# EAGLE board OPBS-Muscle (EAGLE 6.4), part 1 of 2
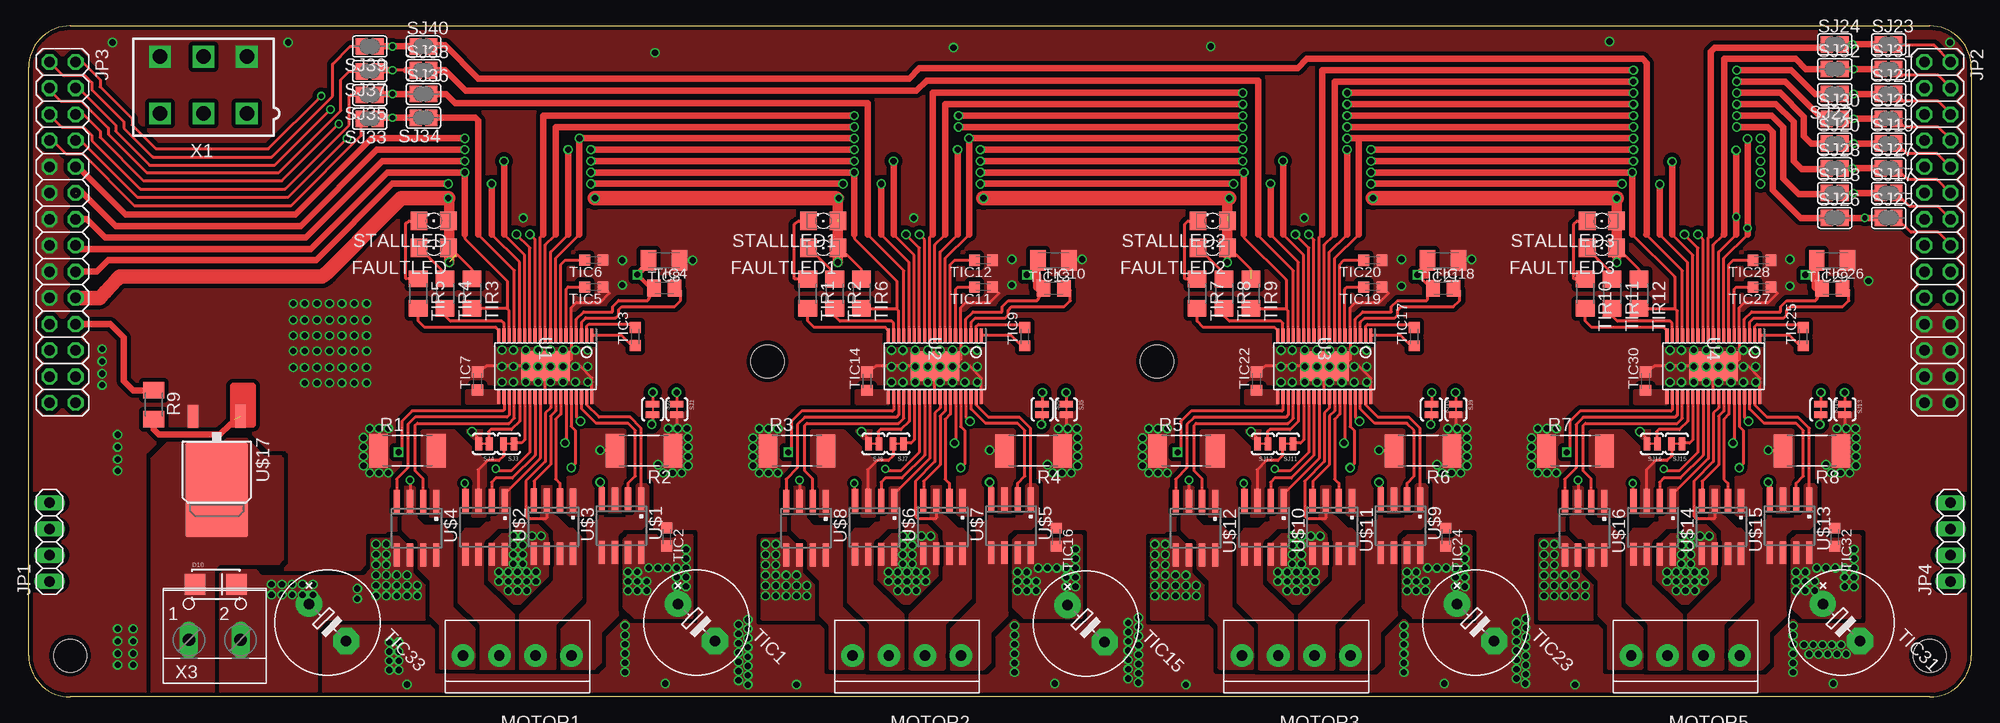
[diagram p7: board, top side]
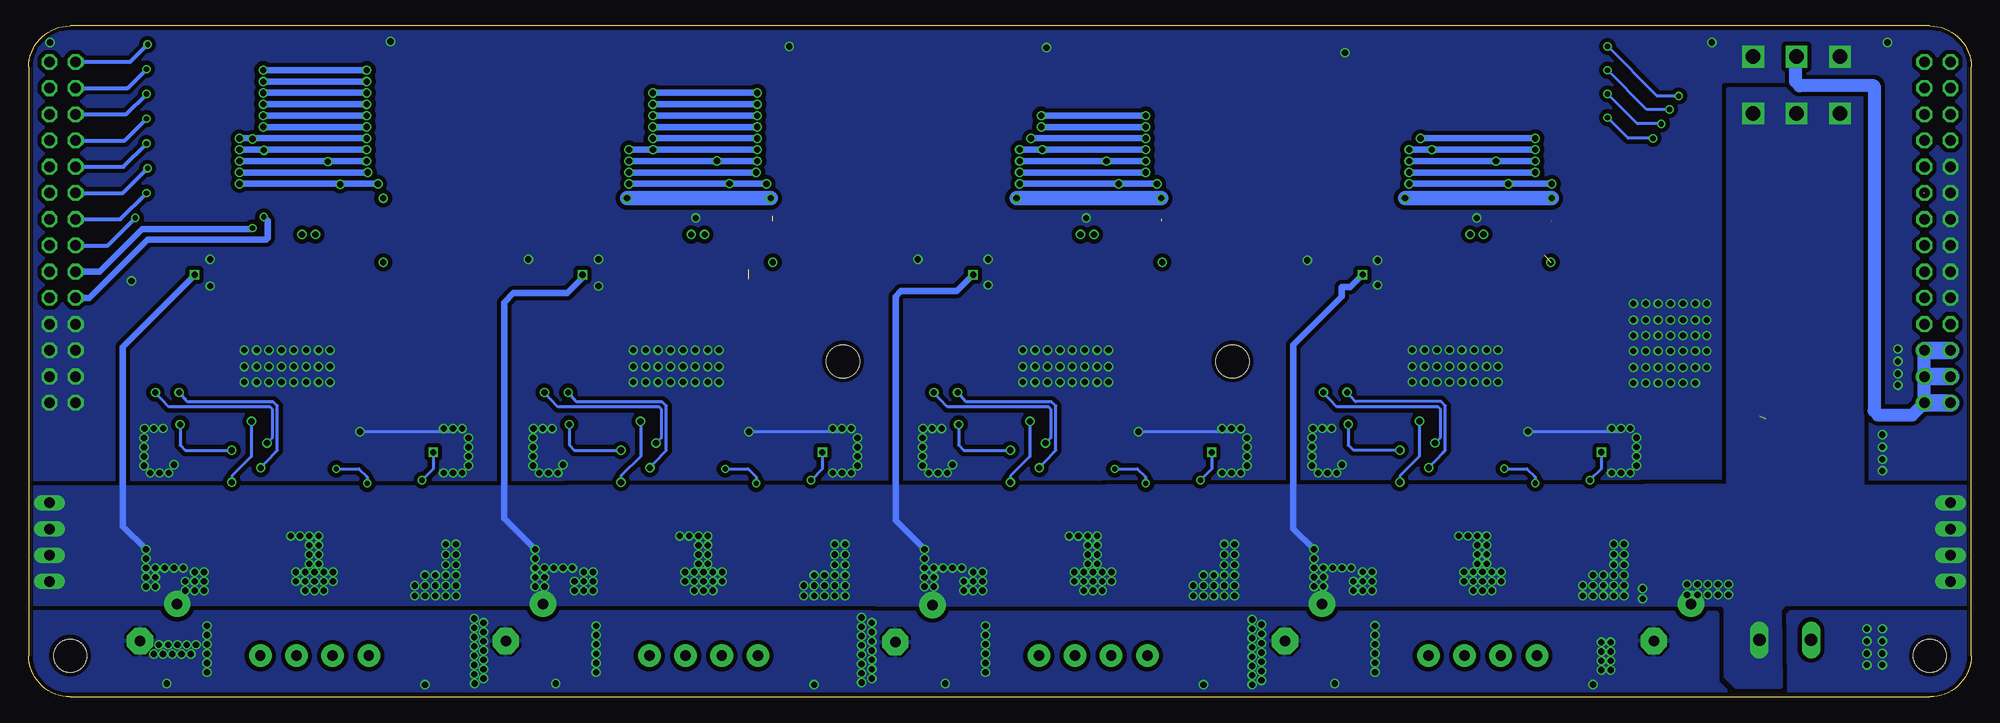
[diagram p8: board, bottom side, seen from below]

Size 188 x 65 mm. Coordinates in mm from the lower left corner, seen from the top.
Outline: 4,65 184,65 arc-90 188,61 188,4 arc-90 184,0 4,0 arc-90 0,4 0,61 arc-90 4,65
Copper layers (1*16): Top 0.035mm / dielectric 1.5mm / Bottom 0.035mm
Design rules "dirt_cheap_dirty_boards.v1": minimum track width 5mil, minimum drill 12mil, track to track 5mil, track to pad 5mil, pad to pad 5mil, via to via 5mil, smd to smd 0mil, copper to edge 10mil, drill to drill 10mil, minimum pad ring 10mil, minimum via ring 6mil, stop-mask expansion 2mil, vias tented up to drill 25mil, thermal gap 10mil
Holes 3.2 mm at 4,4 184,4 71.5,32.5 109.2,32.5

## Footprints (pad centres in the part's own frame; a part is rotated, then mirrored left to right if it is on the bottom)
SMA-DIODE_ALT = smd 2 x 2: A -2,0; C 2,0
1206 = smd 1.6 x 1.803: A -1.422,0; C 1.422,0
1X04 = drill 1.016 long: 1 -3.81,0; 2 -1.27,0; 3 1.27,0; 4 3.81,0
2X14 = drill 1.016 octagon: 1 -16.51,-1.27; 2 -16.51,1.27; 3 -13.97,-1.27; 4 -13.97,1.27; 5 -11.43,-1.27; 6 -11.43,1.27; 7 -8.89,-1.27; 8 -8.89,1.27; 9 -6.35,-1.27; 10 -6.35,1.27; 11 -3.81,-1.27; 12 -3.81,1.27; 13 -1.27,-1.27; 14 -1.27,1.27; 15 1.27,-1.27; 16 1.27,1.27; 17 3.81,-1.27; 18 3.81,1.27; 19 6.35,-1.27; 20 6.35,1.27; 21 8.89,-1.27; 22 8.89,1.27; 23 11.43,-1.27; 24 11.43,1.27; 25 13.97,-1.27; 26 13.97,1.27; 27 16.51,-1.27; 28 16.51,1.27
1X04-3.5MM = drill 1 pad 2.184: 1 -5.25,0; 2 -1.75,0; 3 1.75,0; 4 5.25,0
R2512 = smd 1.8 x 3.2: 1 -2.8,0; 2 2.8,0
M1206 = smd 1.6 x 2: 1 -1.4,0; 2 1.4,0
SJ_2S-TRACE = smd 0.635 x 1.27: 1 -0.508,0; 2 0.508,0
SJ = smd 1.168 x 1.6: 1 -0.762,0; 2 0.762,0
E5-10,5 = drill 1.016 pad 2.54: + -2.54,0 | drill 1.016 pad 2.54 octagon: - 2.54,0
C0603K = smd 1.05 x 1.08: 1 -0.875,0; 2 0.875,0
C0805K = smd 1.3 x 1.6: 1 -1,0; 2 1,0
C1206K = smd 1.5 x 2: 1 -1.5,0; 2 1.5,0
R1206 = smd 1.6 x 1.803: 1 -1.422,0; 2 1.422,0
DCP0038A_N = smd 1.397 x 0.305: 1 -2.95,4.5; 2 -2.95,4; 3 -2.95,3.5; 4 -2.95,3; 5 -2.95,2.5; 6 -2.95,2; 7 -2.95,1.5; 8 -2.95,1; 9 -2.95,0.5; 10 -2.95,0; 11 -2.95,-0.5; 12 -2.95,-1; 13 -2.95,-1.5; 14 -2.95,-2; 15 -2.95,-2.5; 16 -2.95,-3; 17 -2.95,-3.5; 18 -2.95,-4; 19 -2.95,-4.5; 20 2.95,-4.5; 21 2.95,-4; 22 2.95,-3.5; 23 2.95,-3; 24 2.95,-2.5; 25 2.95,-2; 26 2.95,-1.5; 27 2.95,-1; 28 2.95,-0.5; 29 2.95,0; 30 2.95,0.5; 31 2.95,1; 32 2.95,1.5; 33 2.95,2; 34 2.95,2.5; 35 2.95,3; 36 2.95,3.5; 37 2.95,4; 38 2.95,4.5 | smd 2.896 x 4.699: 39 0,0
CSD88537ND = smd 0.6 x 2.2: D1_1 0.635,6.41; D1_2 1.905,6.41; D2_1 3.175,6.41; D22 4.445,6.41; G1 1.905,1.21; G2 4.445,1.21; S1 0.635,1.21; S2 3.175,1.21
D-PAK_TO252AA = smd 1.067 x 2.184: 1 -2.286,-4.572; 3 2.286,-4.572 | smd 6.096 x 9.144: 2 0,2.54
5566-6 = drill 1.4 square: 1 4.2,-2.75; 2 0,-2.75; 3 -4.2,-2.75; 4 4.2,2.75; 5 0,2.75; 6 -4.2,2.75
W237-102 = drill 1.194 long: 1 -2.5,-1.27; 2 2.5,-1.27

## Placement (x,y rotation side)
D10  [SMA-DIODE_ALT]  18.1,10.9 0 top
FAULTLED  RED  [1206]  39.21,43.5 180 top
FAULTLED1  RED  [1206]  76.91,43.49 180 top
FAULTLED2  RED  [1206]  114.6,43.49 180 top
FAULTLED3  RED  [1206]  152.26,43.49 180 top
JP1  [1X04]  2,15 90 top
JP2  [2X14]  184.73,45 270 top
JP3  [2X14]  3.27,45 270 top
JP4  [1X04]  186,15 90 top
MOTOR1  1X4-3.5MM  [1X04-3.5MM]  47.29,4 0 top
MOTOR2  1X4-3.5MM  [1X04-3.5MM]  84.99,4 0 top
MOTOR3  1X4-3.5MM  [1X04-3.5MM]  122.68,4 0 top
MOTOR5  1X4-3.5MM  [1X04-3.5MM]  160.34,4 0 top
R1  [R2512]  36.64,23.85 0 top
R2  [R2512]  59.54,23.85 180 top
R3  [R2512]  74.34,23.84 0 top
R4  [R2512]  97.24,23.84 180 top
R5  [R2512]  112.03,23.84 0 top
R6  [R2512]  134.93,23.84 180 top
R7  [R2512]  149.69,23.84 0 top
R8  [R2512]  172.59,23.84 180 top
R9  10R  [M1206]  12.1,28.3 270 top
SJ1  SOLDERJUMPERTRACE  [SJ_2S-TRACE]  62.72,27.86 270 top
SJ2  SOLDERJUMPERTRACE  [SJ_2S-TRACE]  60.37,27.86 270 top
SJ3  SOLDERJUMPERTRACE  [SJ_2S-TRACE]  46.46,24.52 180 top
SJ4  SOLDERJUMPERTRACE  [SJ_2S-TRACE]  44.06,24.52 180 top
SJ5  SOLDERJUMPERTRACE  [SJ_2S-TRACE]  100.42,27.85 270 top
SJ6  SOLDERJUMPERTRACE  [SJ_2S-TRACE]  98.07,27.85 270 top
SJ7  SOLDERJUMPERTRACE  [SJ_2S-TRACE]  84.16,24.51 180 top
SJ8  SOLDERJUMPERTRACE  [SJ_2S-TRACE]  81.76,24.51 180 top
SJ9  SOLDERJUMPERTRACE  [SJ_2S-TRACE]  138.11,27.85 270 top
SJ10  SOLDERJUMPERTRACE  [SJ_2S-TRACE]  135.76,27.85 270 top
SJ11  SOLDERJUMPERTRACE  [SJ_2S-TRACE]  121.85,24.51 180 top
SJ12  SOLDERJUMPERTRACE  [SJ_2S-TRACE]  119.45,24.51 180 top
SJ13  SOLDERJUMPERTRACE  [SJ_2S-TRACE]  175.77,27.85 270 top
SJ14  SOLDERJUMPERTRACE  [SJ_2S-TRACE]  173.42,27.85 270 top
SJ15  SOLDERJUMPERTRACE  [SJ_2S-TRACE]  159.51,24.51 180 top
SJ16  SOLDERJUMPERTRACE  [SJ_2S-TRACE]  157.11,24.51 180 top
SJ17  [SJ]  180,48.8 0 top
SJ18  [SJ]  174.8,48.8 0 top
SJ19  [SJ]  180,53.6 0 top
SJ20  [SJ]  174.8,53.6 0 top
SJ21  [SJ]  180,58.4 0 top
SJ22  [SJ]  174.8,58.4 180 top
SJ23  [SJ]  180,63.2 0 top
SJ24  [SJ]  174.8,63.2 0 top
SJ25  [SJ]  180,46.4 0 top
SJ26  [SJ]  174.8,46.4 0 top
SJ27  [SJ]  180,51.2 0 top
SJ28  [SJ]  174.8,51.2 0 top
SJ29  [SJ]  180,56 0 top
SJ30  [SJ]  174.8,56 0 top
SJ31  [SJ]  180,60.8 0 top
SJ32  [SJ]  174.8,60.8 0 top
SJ33  [SJ]  33,56 180 top
SJ34  [SJ]  38.2,56.1 180 top
SJ35  [SJ]  33,58.3 180 top
SJ36  [SJ]  38.2,58.4 0 top
SJ37  [SJ]  33,60.6 180 top
SJ38  [SJ]  38.2,60.7 0 top
SJ39  [SJ]  33,63 180 top
SJ40  [SJ]  38.2,63 0 top
STALLLED  RED  [1206]  39.21,46.11 180 top
STALLLED1  RED  [1206]  76.91,46.1 180 top
STALLLED2  RED  [1206]  114.6,46.1 180 top
STALLLED3  RED  [1206]  152.26,46.1 180 top
TIC1  Alu 100uf 100v 20%  [E5-10,5]  64.62,7.21 315 top
TIC2  0.01uf 100v 10% CER  [C0603K]  61.74,15.49 270 top
TIC3  0.1UF 100V 10% CER  [C0603K]  58.7,34.9 90 top
TIC4  1UF 50V 10%  [C0805K]  61.5,39.6 0 top
TIC5  0.1UF 25V 10% CER  [C0603K]  54.7,39.7 180 top
TIC6  1UF 16V 10% CER  [C0603K]  54.7,42.3 180 top
TIC7  1000pF 16v CERM  [C0603K]  43.43,30.59 90 top
TIC8  1UF 100V 10% CER  [C1206K]  61.5,42.3 180 top
TIC9  0.1UF 100V 10% CER  [C0603K]  96.4,34.89 90 top
TIC10  1UF 50V 10%  [C0805K]  99.2,39.59 0 top
TIC11  0.1UF 25V 10% CER  [C0603K]  92.4,39.69 180 top
TIC12  1UF 16V 10% CER  [C0603K]  92.4,42.29 180 top
TIC13  1UF 100V 10% CER  [C1206K]  99.2,42.29 180 top
TIC14  1000pF 16v CERM  [C0603K]  81.13,30.58 90 top
TIC15  Alu 100uf 100v 20%  [E5-10,5]  102.33,7.11 315 top
TIC16  0.01uf 100v 10% CER  [C0603K]  99.44,15.48 270 top
TIC17  0.1UF 100V 10% CER  [C0603K]  134.09,34.89 90 top
TIC18  1UF 50V 10%  [C0805K]  136.89,39.59 0 top
TIC19  0.1UF 25V 10% CER  [C0603K]  130.09,39.69 180 top
TIC20  1UF 16V 10% CER  [C0603K]  130.09,42.29 180 top
TIC21  1UF 100V 10% CER  [C1206K]  136.89,42.29 180 top
TIC22  1000pF 16v CERM  [C0603K]  118.82,30.58 90 top
TIC23  Alu 100uf 100v 20%  [E5-10,5]  140.03,7.21 315 top
TIC24  0.01uf 100v 10% CER  [C0603K]  137.13,15.48 270 top
TIC25  0.1UF 100V 10% CER  [C0603K]  171.75,34.89 90 top
TIC26  1UF 50V 10%  [C0805K]  174.55,39.59 0 top
TIC27  0.1UF 25V 10% CER  [C0603K]  167.75,39.69 180 top
TIC28  1UF 16V 10% CER  [C0603K]  167.75,42.29 180 top
TIC29  1UF 100V 10% CER  [C1206K]  174.55,42.29 180 top
TIC30  1000pF 16v CERM  [C0603K]  156.48,30.58 90 top
TIC31  Alu 100uf 100v 20%  [E5-10,5]  175.43,7.21 315 top
TIC32  0.01uf 100v 10% CER  [C0603K]  174.79,15.48 270 top
TIC33  5  [E5-10,5]  28.92,7.21 315 top
TIR1  330  [R1206]  75.39,39.05 270 top
TIR2  330  [R1206]  78,39.05 270 top
TIR3  3K3  [R1206]  42.91,39.06 270 top
TIR4  330  [R1206]  40.3,39.06 270 top
TIR5  330  [R1206]  37.69,39.06 270 top
TIR6  3K3  [R1206]  80.61,39.05 270 top
TIR7  330  [R1206]  113.08,39.05 270 top
TIR8  330  [R1206]  115.69,39.05 270 top
TIR9  3K3  [R1206]  118.3,39.05 270 top
TIR10  330  [R1206]  150.64,39.05 270 top
TIR11  330  [R1206]  153.25,39.05 270 top
TIR12  3K3  [R1206]  155.86,39.05 270 top
U1  DRV8711  [DCP0038A_N]  50,32.04 270 top
U2  DRV8711  [DCP0038A_N]  87.7,32.03 270 top
U3  DRV8711  [DCP0038A_N]  125.39,32.03 270 top
U4  DRV8711  [DCP0038A_N]  163.05,32.03 270 top
U$1  CSD88537ND  [CSD88537ND]  59.91,20.41 180 top
U$2  CSD88537ND  [CSD88537ND]  46.71,20.25 180 top
U$3  CSD88537ND  [CSD88537ND]  53.31,20.29 180 top
U$4  CSD88537ND  [CSD88537ND]  40.07,20.17 180 top
U$5  CSD88537ND  [CSD88537ND]  97.61,20.4 180 top
U$6  CSD88537ND  [CSD88537ND]  84.41,20.24 180 top
U$7  CSD88537ND  [CSD88537ND]  91.01,20.28 180 top
U$8  CSD88537ND  [CSD88537ND]  77.77,20.16 180 top
U$9  CSD88537ND  [CSD88537ND]  135.3,20.4 180 top
U$10  CSD88537ND  [CSD88537ND]  122.1,20.24 180 top
U$11  CSD88537ND  [CSD88537ND]  128.7,20.28 180 top
U$12  CSD88537ND  [CSD88537ND]  115.46,20.16 180 top
U$13  CSD88537ND  [CSD88537ND]  172.96,20.4 180 top
U$14  CSD88537ND  [CSD88537ND]  159.76,20.24 180 top
U$15  CSD88537ND  [CSD88537ND]  166.36,20.28 180 top
U$16  CSD88537ND  [CSD88537ND]  153.12,20.16 180 top
U$17  IRLR024  [D-PAK_TO252AA]  18.2,22.6 180 top
X1  5566-6  [5566-6]  16.9,59.27 0 top
X3  [W237-102]  18,6.8 0 top